# EAGLE design USB (EAGLE 4.16)
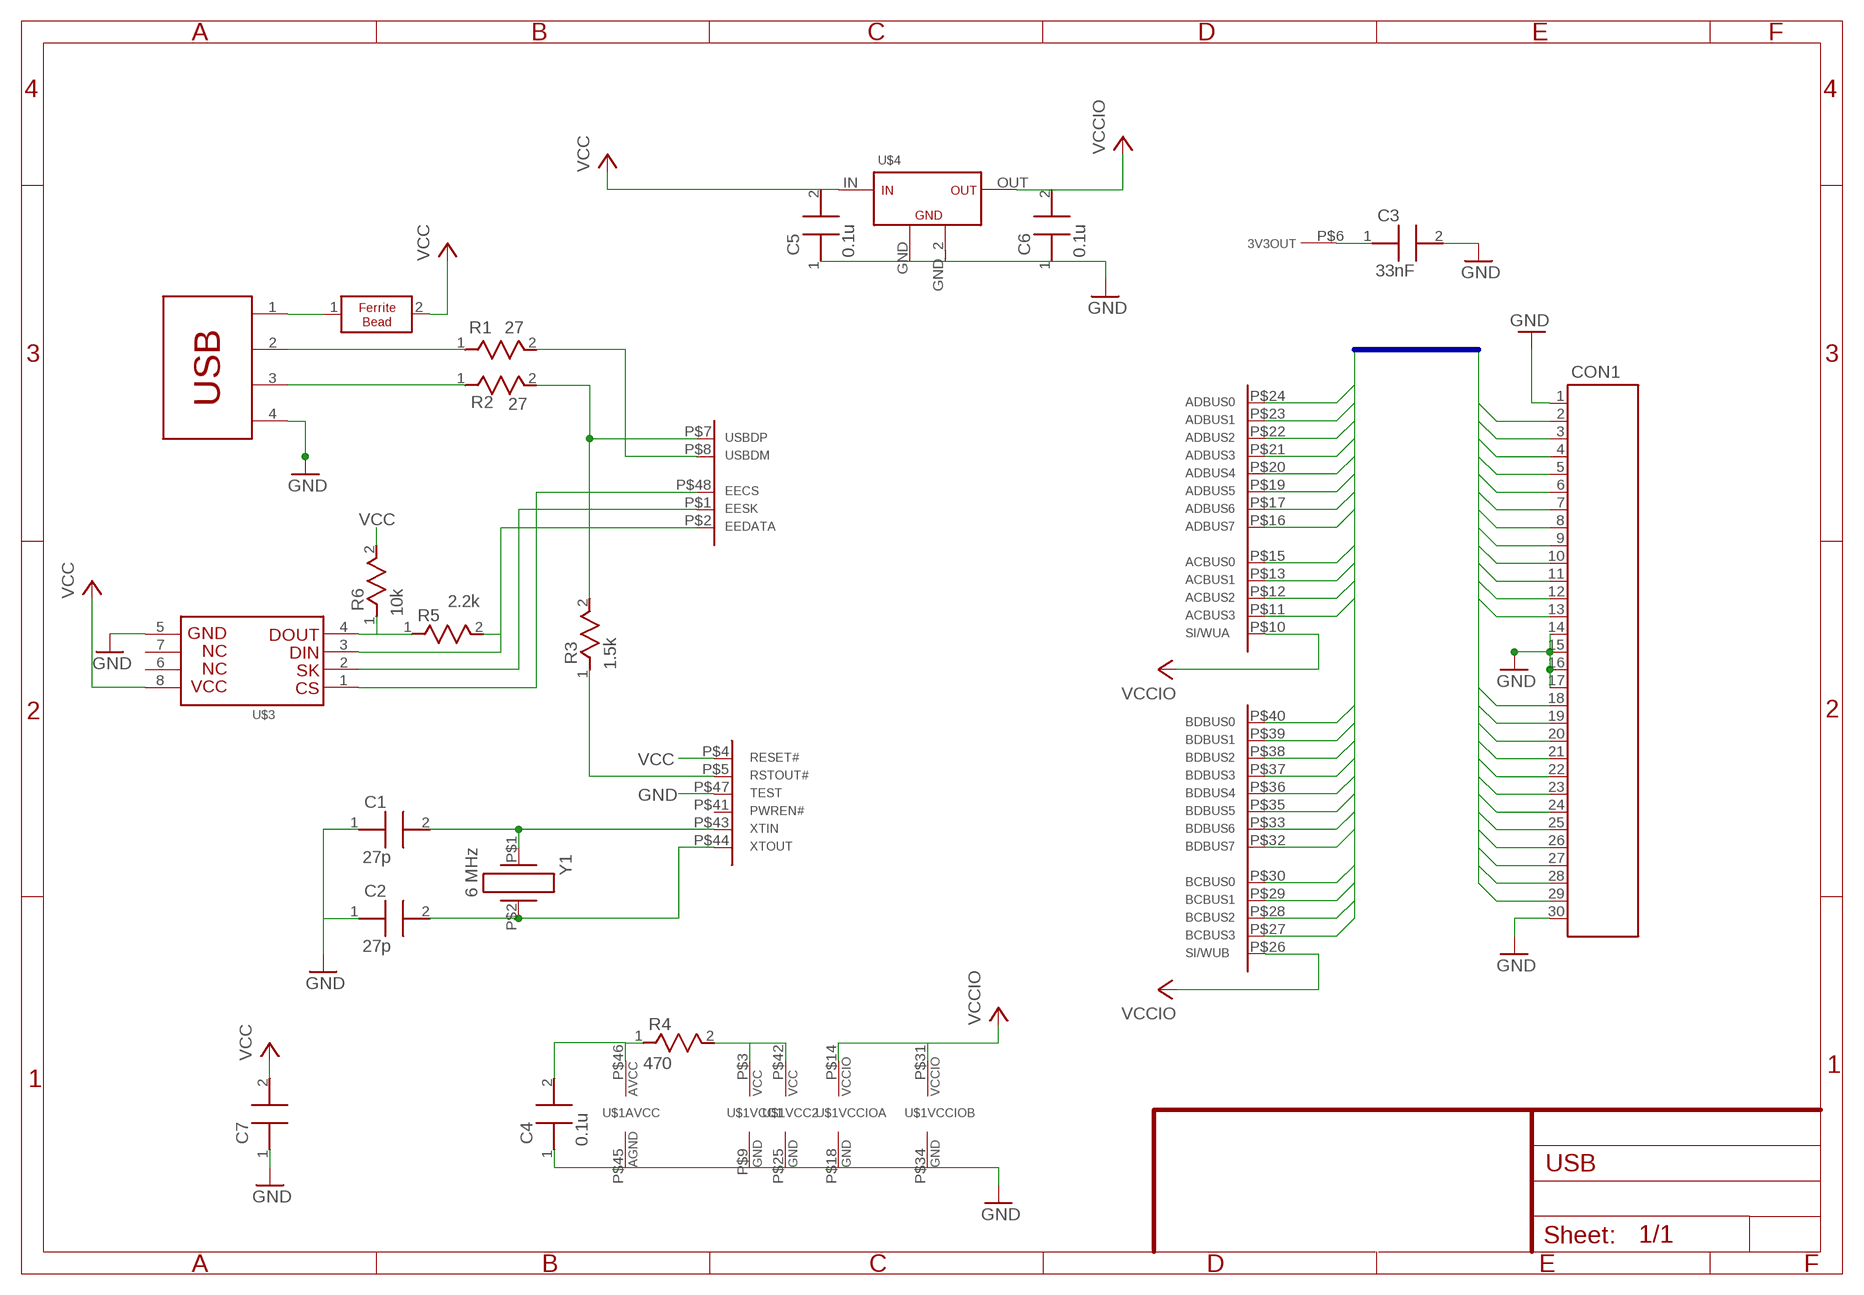
[diagram p0: schematic, sheet 1]

## Parts
C1  27p  C  [1608]
C2  27p  C  [1608]
C3  33nF  C3216  [3216]
C4  0.1u  C  [1608]
C5  0.1u  C  [1608]
C6  0.1u  C  [1608]
C7  C3216  [3216]
CON1  FPC_30  [FPC_30]
FB  FB  FERRITEBEAD3216  [3216]
R1  27  R  [1608]
R2  27  R  [1608]
R3  1.5k  R  [1608]
R4  470  R  [1608]
R5  2.2k  R  [1608]
R6  10k  R  [1608]
U$1  FT2232D  [FT2232D_PAC]
U$2  CN-USB  [CN-USB-67068]
U$3  AT93C46E  [AT93C46-TSSOP]
U$4  LM2937  [LM2937_SOT-223]
Y1  6 MHz  HC49/4H_SMD_CRYSTAL  [SMX_CRYSTAL]

## Nets
AD1: CON1.12 U$1.P$23(ADBUS1)
AD2: CON1.11 U$1.P$22(ADBUS2)
AVCC: C4.2 R4.1 U$1.P$46(AVCC:AVCC)
GND: C1.1 C2.1 C3.2 C4.1 C5.1 C6.1 C7.1 CON1.1 CON1.14 CON1.15 CON1.16 CON1.17 CON1.30 U$1.P$9(VCC1:GND) U$1.P$18(VCCIOA:GND) U$1.P$25(VCC2:GND) U$1.P$34(VCCIOB:GND) U$1.P$45(AVCC:AGND) U$1.P$47(TEST) U$2.4 U$3.5(GND) U$4.GND U$4.GND_2
N$1: C1.2 U$1.P$43(XTIN) Y1.P$1
N$2: C2.2 U$1.P$44(XTOUT) Y1.P$2
N$3: R1.1 U$2.2
N$4: R2.1 U$2.3
N$5: R1.2 U$1.P$8(USBDM)
N$6: R2.2 R3.2 U$1.P$7(USBDP)
N$7: R3.1 U$1.P$5(RSTOUT#)
N$8: FB.1 U$2.1
N$9: C3.1 U$1.P$6(3V3OUT)
N$11: CON1.25 U$1.P$36(BDBUS4)
N$12: U$1.P$1(EESK) U$3.2(SK)
N$13: U$1.P$48(EECS) U$3.1(CS)
N$14: R5.2 U$1.P$2(EEDATA) U$3.3(DIN)
N$15: R5.1 R6.1 U$3.4(DOUT)
N$17: CON1.24 U$1.P$35(BDBUS5)
N$18: CON1.23 U$1.P$33(BDBUS6)
N$19: CON1.22 U$1.P$32(BDBUS7)
N$20: CON1.21 U$1.P$30(BCBUS0)
N$21: CON1.20 U$1.P$29(BCBUS1)
N$22: CON1.19 U$1.P$28(BCBUS2)
N$23: CON1.18 U$1.P$27(BCBUS3)
N$24: CON1.26 U$1.P$37(BDBUS3)
N$25: CON1.27 U$1.P$38(BDBUS2)
N$26: CON1.28 U$1.P$39(BDBUS1)
N$27: CON1.29 U$1.P$40(BDBUS0)
N$28: CON1.13 U$1.P$24(ADBUS0)
N$29: CON1.10 U$1.P$21(ADBUS3)
N$30: CON1.9 U$1.P$20(ADBUS4)
N$31: CON1.8 U$1.P$19(ADBUS5)
N$36: CON1.7 U$1.P$17(ADBUS6)
N$37: CON1.6 U$1.P$16(ADBUS7)
N$38: CON1.5 U$1.P$15(ACBUS0)
N$39: CON1.4 U$1.P$13(ACBUS1)
N$40: CON1.3 U$1.P$12(ACBUS2)
N$41: CON1.2 U$1.P$11(ACBUS3)
VCC: C5.2 C7.2 FB.2 R4.2 R6.2 U$1.P$3(VCC1:VCC) U$1.P$4(RESET#) U$1.P$42(VCC2:VCC) U$3.8(VCC) U$4.IN
VCCIO: C6.2 U$1.P$10(SI/WUA) U$1.P$14(VCCIOA:VCCIO) U$1.P$26(SI/WUB) U$1.P$31(VCCIOB:VCCIO) U$4.OUT
Unconnected: U$1.P$41(PWREN#) U$3.6 U$3.7

## Buses
BUS1:AD[0..7],AC[0..3],BD[0..7],BC[0..3]

## Notes on the sheet
- VCC
- VCC
- GND

## Library data of the parts
C1-C7 = FTDI:C
CON1 = FTDI:FPC_30
FB = ferriteBead:FERRITEBEAD
R1-R6 = FTDI:R
U$1 = FTDI:FT2232D
U$2 = FTDI:CN-USB
U$3 = FTDI:AT93C46E
U$4 = FTDI:LM2937
Y1 = FTDI:HC49/4H_SMD_CRYSTAL

## Board
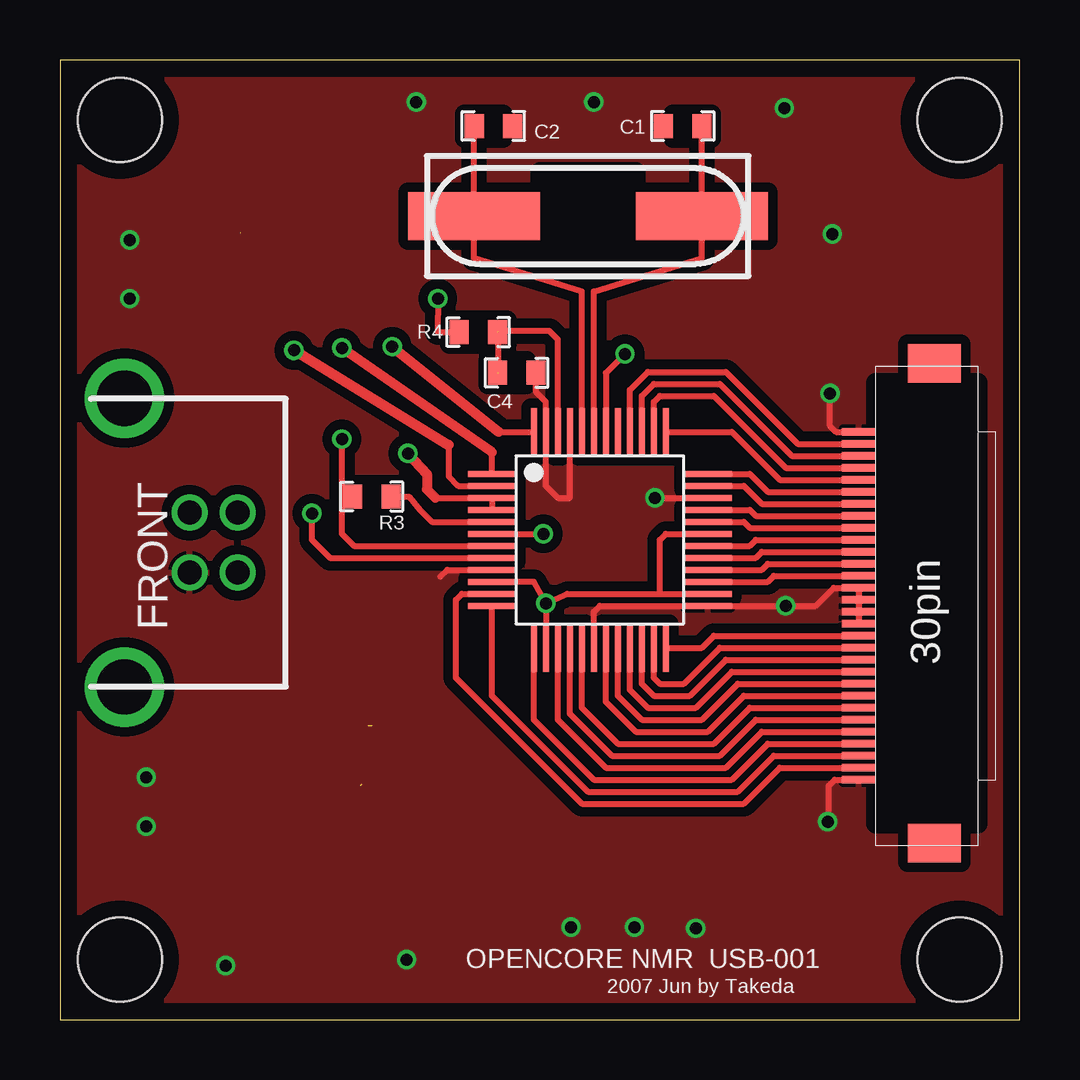
[diagram p1: board, top side]
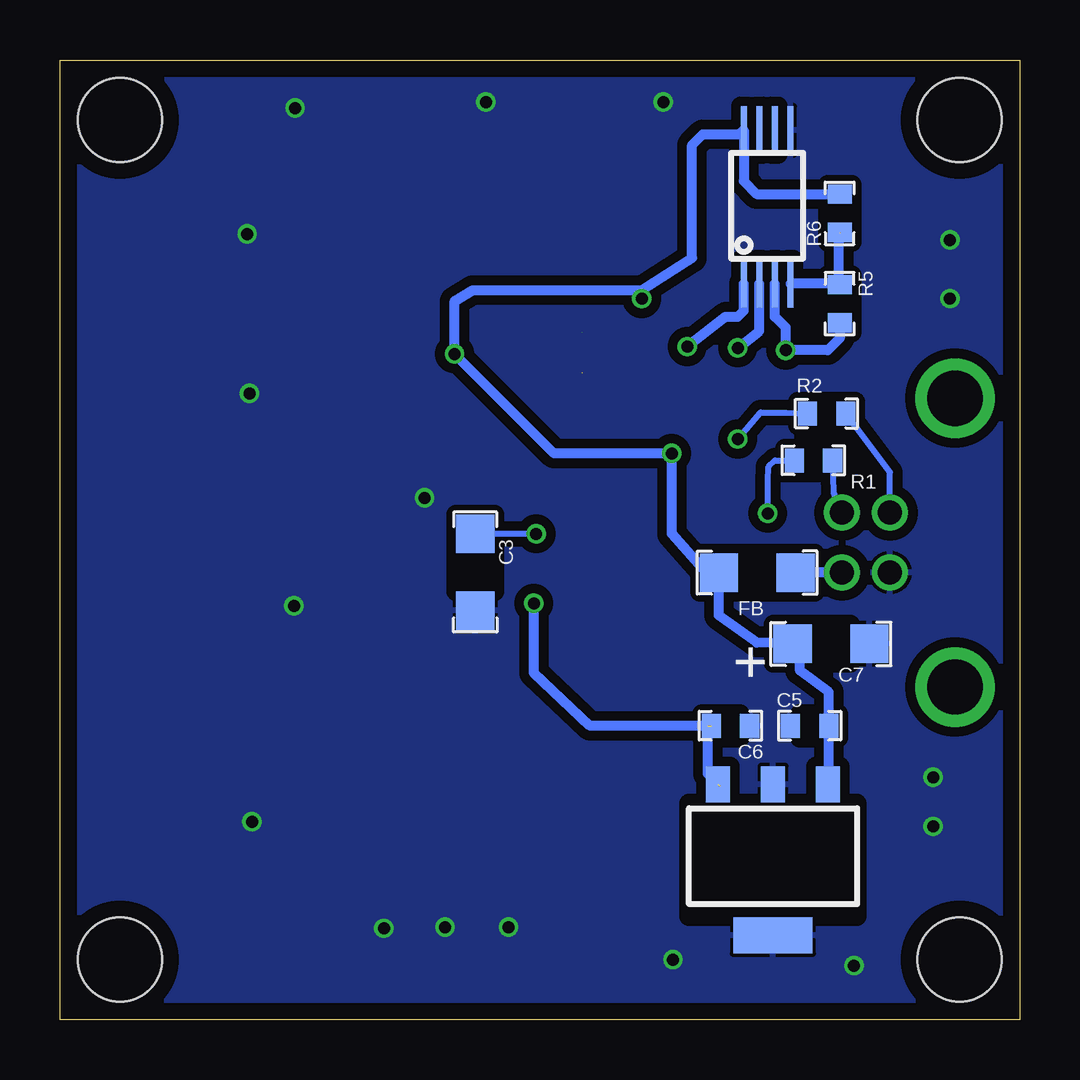
[diagram p2: board, bottom side, seen from below]

Size 40 x 40 mm. Coordinates in mm from the lower left corner, seen from the top.
Outline: 0,0 40,0 40,40 0,40 0,0
Copper layers (1*16): Top 0.035mm / dielectric 1.5mm / Bottom 0.035mm
Design rules "p-ban_min": minimum track width 0.15mm, minimum drill 0.3mm, track to track 0.15mm, track to pad 0.15mm, pad to pad 0.15mm, via to via 0.15mm, smd to smd 0.15mm, copper to edge 0.7mm, drill to drill 0.45mm, minimum pad ring 0.15mm, minimum via ring 0.15mm, stop-mask expansion 4mil, vias tented up to drill 0mil, thermal gap 0.15mm
Holes 3.5 mm at 2.5,2.5 37.5,2.5 37.5,37.5 2.5,37.5

### Footprints (pad centres in the part's own frame; a part is rotated, then mirrored left to right if it is on the bottom)
1608 = smd 0.8 x 1: 1 -0.8,0; 2 0.8,0
3216 = smd 1.6 x 1.6: 1 -1.63,0; 2 1.57,0
FPC_30 = smd 0.3 x 1.4: 1 -7,2.7; 2 -6.5,2.7; 3 -6,2.7; 4 -5.5,2.7; 5 -5,2.7; 6 -4.5,2.7; 7 -4,2.7; 8 -3.5,2.7; 9 -3,2.7; 10 -2.5,2.7; 11 -2,2.7; 12 -1.5,2.7; 13 -1,2.7; 14 -0.5,2.7; 15 0,2.7; 16 0.5,2.7; 17 1,2.7; 18 1.5,2.7; 19 2,2.7; 20 2.5,2.7; 21 3,2.7; 22 3.5,2.7; 23 4,2.7; 24 4.5,2.7; 25 5,2.7; 26 5.5,2.7; 27 6,2.7; 28 6.5,2.7; 29 7,2.7; 30 7.5,2.7 | smd 1.6 x 2.2: P$21 -9.65,-0.45; P$22 10.35,-0.45
FT2232D_PAC = smd 2 x 0.25: P$1 -4.5,2.75; P$2 -4.5,2.25; P$3 -4.5,1.75; P$4 -4.5,1.25; P$5 -4.5,0.75; P$6 -4.5,0.25; P$7 -4.5,-0.25; P$8 -4.5,-0.75; P$9 -4.5,-1.25; P$10 -4.5,-1.75; P$11 -4.5,-2.25; P$12 -4.5,-2.75; P$25 4.5,-2.75; P$26 4.5,-2.25; P$27 4.5,-1.75; P$28 4.5,-1.25; P$29 4.5,-0.75; P$30 4.5,-0.25; P$31 4.5,0.25; P$32 4.5,0.75; P$33 4.5,1.25; P$34 4.5,1.75; P$35 4.5,2.25; P$36 4.5,2.75 | smd 0.25 x 2: P$13 -2.75,-4.5; P$14 -2.25,-4.5; P$15 -1.75,-4.5; P$16 -1.25,-4.5; P$17 -0.75,-4.5; P$18 -0.25,-4.5; P$19 0.25,-4.5; P$20 0.75,-4.5; P$21 1.25,-4.5; P$22 1.75,-4.5; P$23 2.25,-4.5; P$24 2.75,-4.5; P$37 2.75,4.5; P$38 2.25,4.5; P$39 1.75,4.5; P$40 1.25,4.5; P$41 0.75,4.5; P$42 0.25,4.5; P$43 -0.25,4.5; P$44 -0.75,4.5; P$45 -1.25,4.5; P$46 -1.75,4.5; P$47 -2.25,4.5; P$48 -2.75,4.5
CN-USB-67068 = drill 1 round: 1 7.25,14.99; 2 4.75,14.99; 3 4.75,12.99; 4 7.25,12.99 | drill 2.3 round: SPT1 -0.02,10.28; SPT2 12.02,10.28
AT93C46-TSSOP = smd 2 x 0.25: 1 -3.25,1.3; 2 -3.25,0.65; 3 -3.25,0; 4 -3.25,-0.65; 5 3.15,-0.65; 6 3.15,0; 7 3.15,0.65; 8 3.15,1.3
LM2937_SOT-223 = smd 1 x 1.5: GND 0,0; IN -2.3,0; OUT 2.3,0 | smd 3.3 x 1.5: GND_2 0,6.3
SMX_CRYSTAL = smd 5.5 x 2: P$1 -4.75,0; P$2 4.75,0

### Placement (x,y rotation side)
C1  25.96,37.25 0 top
C2  18.07,37.25 180 top
C3  22.69,18.62 270 bottom
C4  19.04,26.96 180 top
C5  8.75,12.25 0 bottom
C6  12.05,12.25 180 bottom
C7  7.89,15.66 180 bottom
CON1  36,17 90 top
FB  10.96,18.63 180 bottom
R1  8.59,23.31 180 bottom
R2  8.04,25.26 180 bottom
R3  13,21.8 180 top
R4  17.44,28.66 180 top
R5  7.5,29.84 270 bottom
R6  7.5,33.61 90 bottom
U$1  22.5,20 0 top
U$2  -7.59,25.88 270 top
U$3  10.2,33.92 90 bottom
U$4  10.28,9.81 180 bottom
Y1  22,33.5 180 top

### Tracks (layer width: path | path; a pad name or v marks a point on that pad's centre or on a via)
AD1
  Top 0.254: U$1.P$23 24.75,14.25 25,14 26,14 27.5,15.5 CON1.12
AD2
  Top 0.254: U$1.P$22 24.25,14 24.75,13.5 26.25,13.5 27.75,15 CON1.11
AVCC  (2 unrouted)
  Top 0.254: U$1.P$46 20.75,28.35 20.4,28.7 18.3,28.7 R4.1 C4.2
GND  (via drill 0.5)
  Top 0.254: U$1.P$18 22.25,17 22.5,17.25 U$1.P$25 v30.25,17.25 31.5,17.25 32.25,18 CON1.17 CON1.16 CON1.15 CON1.14 | v24.8,21.75 U$1.P$34 | U$1.P$45 21.25,21.75 20.75,21.75 20.25,22.25 U$1.P$47 20.25,25.75 19.85,26.15 C4.1 | CON1.1 32.3,10 32.05,9.75 32.05,8.3 v32,8.25 | CON1.30 32.35,24.5 32.1,24.75 v32.1,26.1 | U$1.P$9 16.15,18.75 15.85,18.45
  other vias: 21.3,3.85 30.2,38 2.9,32.5 3.6,8.05 23.95,3.85 26.5,3.8 32.2,32.75 14.85,38.25 22.25,38.25 2.9,30.05 3.6,10.1 14.45,2.5 6.9,2.25
  pour Bottom (isolate 0.406): 0,0 40,0 40,40 0,40
  pour Top (isolate 0.406): 0,0 40,0 40,40 0,40
N$1
  Top 0.254: U$1.P$43 22.25,30.35 26.75,31.75 Y1.P$1 C1.2
N$2
  Top 0.254: U$1.P$44 21.75,30.35 17.25,31.75 Y1.P$2 17.25,37.23 C2.2
N$3
  Bottom 0.254: R1.1 7.74,21.97 U$2.2
N$4
  Bottom 0.254: R2.1 5.4,22.82 U$2.3
N$5  (via drill 0.5)
  Top 0.254: U$1.P$8 11.25,19.25 10.5,20 v10.5,21.1
  Bottom 0.254: R1.2 10.19,23.31 10.46,23.05 10.49,22.44 v10.5,21.1
N$6  (via drill 0.5)
  Top 0.254: U$1.P$7 12.25,19.75 11.75,20.25 11.75,21.8 | 11.75,21.8 v11.75,24.2 | 11.75,21.8 R3.2
  Bottom 0.254: v11.75,24.2 10.79,25.3 9.95,25.3 9.73,25.3 R2.2
N$7
  Top 0.254: U$1.P$5 15.5,20.75 15,21.25 14.55,21.8 R3.1
N$8
  Bottom 0.406: U$2.1 FB.1
N$9  (via drill 0.5)
  Top 0.254: U$1.P$6 v20.15,20.25
  Bottom 0.254: v20.15,20.25 C3.1 23,20.26
N$11
  Top 0.254: CON1.25 29.5,22 28.75,22.75 U$1.P$36
N$12  (via drill 0.5)
  Top 0.254: U$1.P$1 18,23.65
  Top 0.406: 18,23.65 v11.75,28
  Bottom 0.406: U$3.2 10.85,28.7 v11.75,28
N$13  (via drill 0.5)
  Top 0.254: 18.3,24.5 U$1.P$48
  Top 0.406: v13.85,28.05 18.3,24.5
  Bottom 0.406: U$3.1 11.5,29.55 11.75,29.3 12.25,29.3 v13.85,28.05
N$14  (via drill 0.5)
  Top 0.254: U$1.P$2 16.6,22.25 16.2,22.65 16.2,23.95
  Top 0.406: v9.75,27.9 16.2,23.95
  Bottom 0.406: U$3.3 10.2,29.3 9.75,28.85 v9.75,27.9 8,27.9 7.5,28.4 R5.2
N$15  (1 unrouted)
  Bottom 0.406: 7.53,30.67 U$3.4 | R5.1 7.53,30.67 | 7.53,30.67 7.53,32.75 7.5,32.78
N$17
  Top 0.254: CON1.24 29.25,21.5 28.5,22.25 U$1.P$35
N$18
  Top 0.254: CON1.23 29,21 28.75,21.25 U$1.P$33
N$19
  Top 0.254: CON1.22 28.75,20.5 28.5,20.75 U$1.P$32
N$20
  Top 0.254: CON1.21 29,20 28.75,19.75 U$1.P$30
N$21
  Top 0.254: CON1.20 29.25,19.5 29,19.25 U$1.P$29
N$22
  Top 0.254: CON1.19 29.5,19 29.25,18.75 U$1.P$28
N$23
  Top 0.254: CON1.18 29.75,18.5 29.5,18.25 U$1.P$27
N$24
  Top 0.254: CON1.26 30,22.5 28,24.5 U$1.P$37
N$25
  Top 0.254: CON1.27 30.25,23 27.25,26 25,26 24.75,25.75 U$1.P$38
N$26
  Top 0.254: CON1.28 30.5,23.5 27.5,26.5 24.75,26.5 24.25,26 U$1.P$39
N$27
  Top 0.254: CON1.29 30.75,24 27.75,27 24.5,27 23.75,26.25 U$1.P$40
N$28
  Top 0.254: CON1.13 27.25,16 26.75,15.5 U$1.P$24
N$29
  Top 0.254: CON1.10 28,14.5 26.5,13 24.5,13 23.75,13.75 U$1.P$21
N$30
  Top 0.254: CON1.9 28.25,14 26.75,12.5 24.25,12.5 23.25,13.5 U$1.P$20
N$31
  Top 0.254: CON1.8 28.5,13.5 27,12 24,12 22.75,13.25 U$1.P$19
N$36
  Top 0.254: CON1.7 28.75,13 27.25,11.5 23.25,11.5 21.75,13 U$1.P$17
N$37
  Top 0.254: CON1.6 29,12.5 27.5,11 23,11 21.25,12.75 U$1.P$16
N$38
  Top 0.254: CON1.5 29.25,12 27.75,10.5 22.75,10.5 20.75,12.5 U$1.P$15
N$39
  Top 0.254: CON1.4 29.5,11.5 28,10 22.25,10 19.75,12.5 U$1.P$13
N$40
  Top 0.254: CON1.3 29.75,11 28.25,9.5 22,9.5 18,13.5 U$1.P$12
N$41
  Top 0.254: CON1.2 30,10.5 28.5,9 21.75,9 16.5,14.25 16.5,17.5 16.75,17.75 U$1.P$11
VCC  (via drill 0.5)
  Top 0.254: U$1.P$4 U$1.P$3 15.65,21.75 | U$1.P$42 22.75,26.95 v23.55,27.75 | R4.2 15.74,28.66 v15.75,30.05
  Top 0.406: 15.65,21.75 15.3,22.1 15.3,22.75 v14.5,23.6
  Bottom 0.254: 15.75,30.4 v15.75,30.05
  Bottom 0.406: U$4.IN 7.95,9.84 C5.2 7.95,13.65 9.15,14.55 9.15,15.67 C7.2 10.95,15.71 12.54,16.85 FB.2 13.06,18.61 14.5,20.25 v14.5,23.6 19.4,23.6 v23.55,27.75 23.55,29.95 22.8,30.4 15.75,30.4 13.65,31.75 13.65,36.45 13.2,36.9 11.67,36.9 U$3.8 11.5,34.95 10.96,34.41 R6.2
VCCIO  (via drill 0.5)  (2 unrouted)
  Top 0.254: v20.25,17.35 U$1.P$14 | v20.25,17.35 21.15,17.75 25,17.75 | 25,17.75 U$1.P$26 | U$1.P$31 25.25,20.25 25,20 25,17.75 | U$1.P$10 19.75,18.25 v20.25,17.35
  Bottom 0.406: v20.25,17.35 20.25,14.45 17.9,12.25 13,12.25 13,10.25 12.5,9.75

### Text on the board
tNames: OPENCORE NMR USB-001 | 2007 Jun by Takeda
bNames: +